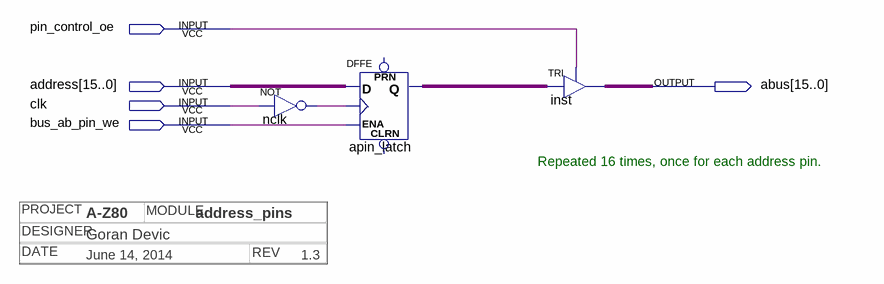
[diagram p0: schematic sheet]
// Quartus schematic address_pins.bdf as structural Verilog: 3 symbols, 5 pins
// Title block: PROJECT: A-Z80; MODULE: address_pins; DESIGNER: Goran Devic; DATE: June 14, 2014; REV: 1.3
module address_pins (
  input  pin_control_oe,
  input  [15:0] address,
  input  clk,
  input  bus_ab_pin_we,
  output [15:0] abus
);

  wire nclk_out;
  wire [15:0] apin_latch_q;

  not nclk (nclk_out, clk);
  DFFE apin_latch[15:0] (.D(address), .CLK(nclk_out), .ENA(bus_ab_pin_we), .Q(apin_latch_q));  // open: PRN, CLRN
  TRI inst[15:0] (.IN(apin_latch_q), .OE(pin_control_oe), .OUT(abus));

  // Notes on the sheet:
  //   Repeated 16 times, once for each address pin.
endmodule
